# EAGLE design 7660 (EAGLE 9.6.2)
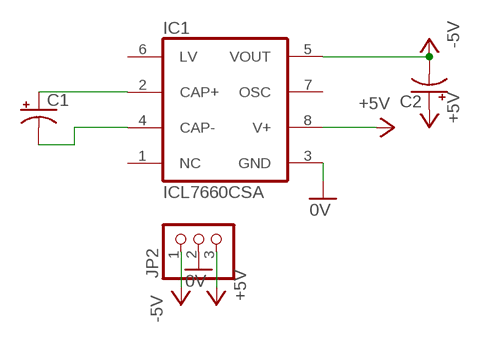
[diagram p0: schematic, sheet 1]

## Parts
C1  CPOL-USE2,5-6E  [E2,5-6E]
C2  CPOL-USE2,5-6E  [E2,5-6E]
IC1  ICL7660CSA  [SO08]
JP2  PINHD-1X3  [1X03]

## Nets
0V: IC1.3(GND) JP2.2
+5V: C2.+ IC1.8(V+) JP2.3
-5V: C2.- IC1.5(VOUT) JP2.1
N$1: C1.+ IC1.2(CAP+)
N$2: C1.- IC1.4(CAP-)
Unconnected: IC1.1(NC) IC1.6(LV) IC1.7(OSC)

## Library data of the parts
C1 C2 = rcl:CPOL-US: POLARIZED CAPACITOR, American symbol; SPICEPREFIX: C
IC1 = maxim:ICL7660CSA: VOLTAGE CONVERTER; MF: MAXIM; MPN: ICL7660CSA; OC_FARNELL: 9724710; OC_NEWARK: 34C3732
JP2 = pinhead:PINHD-1X3: PIN HEADER

## Board
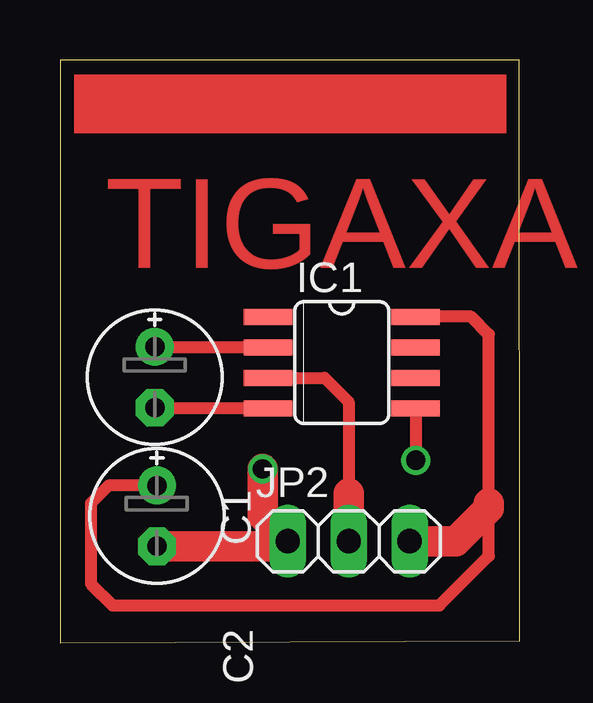
[diagram p1: board, top side]
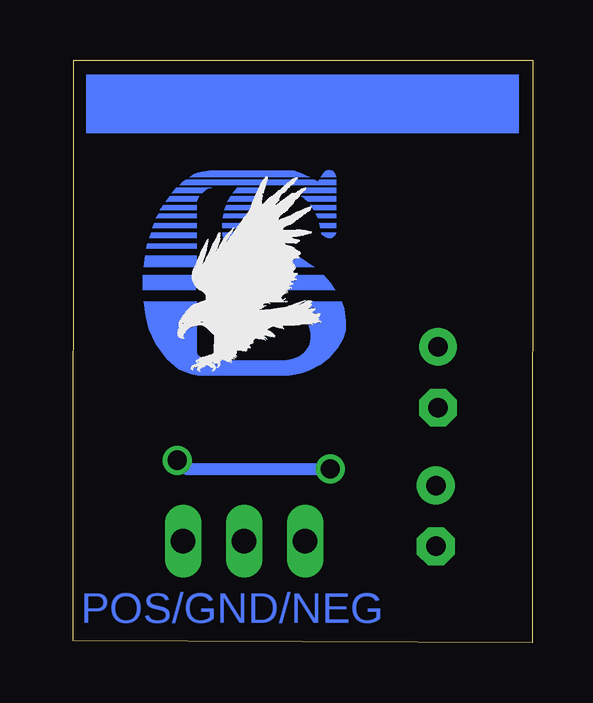
[diagram p2: board, bottom side, seen from below]

Size 19.15 x 24.3 mm. Coordinates in mm from the lower left corner, seen from the top.
Outline: 0.02,0 19.15,0.08 19.13,24.28 0,24.3 0.02,0
Copper layers (1*16): Top 0.035mm / dielectric 1.5mm / Bottom 0.035mm
Design rules "default": minimum track width 6mil, minimum drill 0.35mm, track to track 6mil, track to pad 6mil, pad to pad 6mil, via to via 6mil, smd to smd 6mil, copper to edge 40mil, drill to drill 6mil, minimum pad ring 10mil, minimum via ring 8mil, stop-mask expansion 4mil, vias tented up to drill 0mil, thermal gap 10mil

### Footprints (pad centres in the part's own frame; a part is rotated, then mirrored left to right if it is on the bottom)
E2,5-6E = drill 0.813 pad 1.575: + -1.27,0 | drill 0.813 pad 1.575 octagon: - 1.27,0
SO08 = smd 0.66 x 2.032: 1 -1.905,-3.073; 2 -0.635,-3.073; 3 0.635,-3.073; 4 1.905,-3.073; 5 1.905,3.073; 6 0.635,3.073; 7 -0.635,3.073; 8 -1.905,3.073
1X03 = drill 1.016 long: 1 -2.54,0; 2 0,0; 3 2.54,0

### Placement (x,y rotation side)
C1  3.95,11.07 270 top
C2  4.04,5.29 270 top
IC1  11.74,11.68 270 top
JP2  12.03,4.23 0 top
U$1  [CS-LOGO-TOP-8MM]  16.27,11.14 0 bottom

### Tracks (layer width: path | path; a pad name or v marks a point on that pad's centre or on a via)
0V
  Top 0.508: IC1.3 11.03,11.04 12.03,10.04 12.03,6.23
  Top 1.27: JP2.2 12.03,6.23
+5V
  Top 0.508: JP2.3 16.63,4.23 17.87,5.47 | IC1.8 14.83,13.6 17.13,13.6 17.87,12.86 17.87,5.82 17.87,5.47 | C2.+ 2.03,6.56 1.29,5.82 | 1.29,5.82 | 1.29,5.82 1.29,2.46 2.19,1.56 15.81,1.56 17.87,3.62 17.87,5.47
  Top 1.27: JP2.3 16.5,4.23 17.87,5.6 17.87,5.82
-5V  (via drill 0.8)
  Top 0.508: 9.28,4.02 JP2.1 8.44,5.26 | IC1.5 v14.81,7.62 v14.82,7.61
  Top 1.27: C2.- 9.28,4.02 JP2.1 8.44,5.28 v8.44,7.25
  Bottom 0.508: v14.82,7.61 14.46,7.25 v8.44,7.25
N$1
  Top 0.508: IC1.2 3.98,12.31 C1.+
N$2
  Top 0.508: IC1.4 3.98,9.77 C1.-
(copper drawn outside any net)
  shapes: Bottom area x1, Top area x1

### Text on the board
Top: TIGAXA
Bottom: POS/GND/NEG